# EAGLE design networking-node (EAGLE 7.6.0)
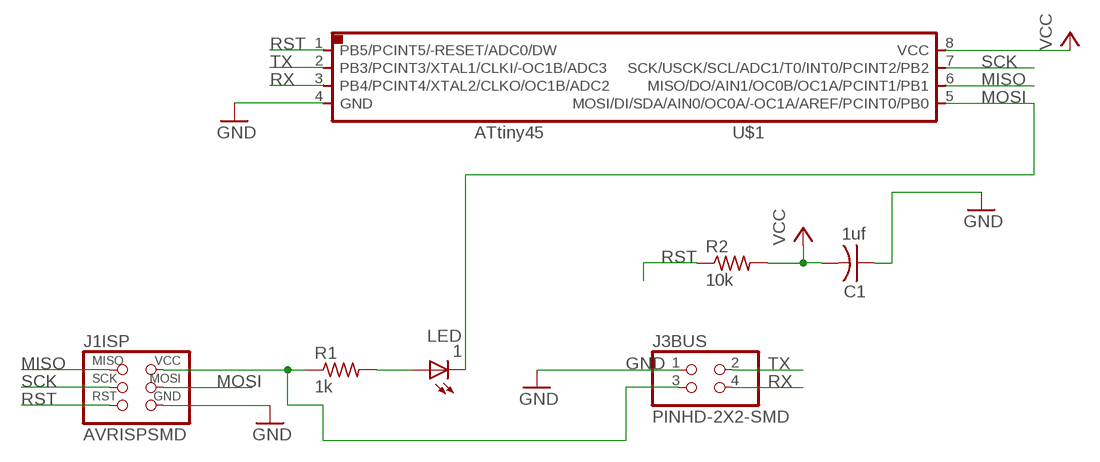
[diagram p0: schematic, sheet 1]

## Parts
1  LED  [LED1206]
C1  1uf  CAP-US1206FAB  [C1206FAB]
J1ISP  AVRISPSMD  [2X03SMD]
J3BUS  PINHD-2X2-SMD  [2X02SMD]
R1  1k  RES-US1206  [R1206]
R2  10k  RES-US1206  [R1206]
U$1  ATTINY45SI  [SOIC8]

## Nets
GND: C1.1 J1ISP.6(GND) J3BUS.1 U$1.4(GND)
MISO: J1ISP.1(MISO) U$1.6(MISO/DO/AIN1/OC0B/OC1A/PCINT1/PB1)
MOSI: 1.2(C) J1ISP.4(MOSI) U$1.5(MOSI/DI/SDA/AIN0/OC0A/-OC1A/AREF/PCINT0/PB0)
N$2: J1ISP.2(VCC) J3BUS.3
N$15: 1.1(A) R1.2
RST: J1ISP.5(RST) R2.1 U$1.1(PB5/PCINT5/-RESET/ADC0/DW)
RX: J3BUS.4 U$1.3(PB4/PCINT4/XTAL2/CLKO/OC1B/ADC2)
SCK: J1ISP.3(SCK) U$1.7(SCK/USCK/SCL/ADC1/T0/INT0/PCINT2/PB2)
TX: J3BUS.2 U$1.2(PB3/PCINT3/XTAL1/CLKI/-OC1B/ADC3)
VCC: C1.2 R2.2 U$1.8(VCC)
Unconnected: R1.1

## Library data of the parts
1 = fab:LED: LED
C1 = fab:CAP-US
J1ISP = fab:AVRISP
J3BUS = fab:PINHD-2X2-SMD
R1 R2 = fab:RES-US: Resistor (US Symbol) Variants with postfix FAB are widened to allow the routing of internal traces
U$1 = fab:ATTINY45

## Board
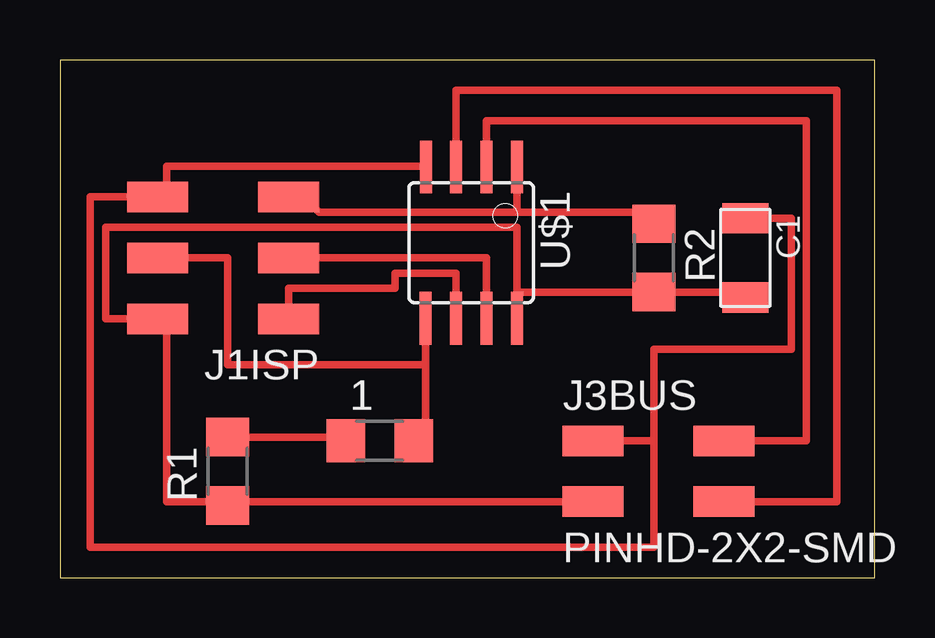
[diagram p1: board, top side]

Size 33.96 x 21.58 mm. Coordinates in mm from the lower left corner, seen from the top.
Outline: 0,0 33.96,0 33.96,21.58 0,21.58 0,0
Copper layers (1*16): Top 0.035mm / dielectric 1.5mm / Bottom 0.035mm
Design rules "default": minimum track width 10mil, minimum drill 24mil, track to track 8mil, track to pad 8mil, pad to pad 8mil, via to via 8mil, smd to smd 8mil, copper to edge 40mil, drill to drill 8mil, minimum pad ring 10mil, minimum via ring 8mil, stop-mask expansion 4mil, vias tented up to drill 0mil, thermal gap 10mil

### Footprints (pad centres in the part's own frame; a part is rotated, then mirrored left to right if it is on the bottom)
LED1206 = smd 1.6 x 1.803: 1 -1.422,0; 2 1.422,0
C1206FAB = smd 1.27 x 1.905: 1 -1.651,0; 2 1.651,0
2X03SMD = smd 2.54 x 1.27: 1 -2.54,2.54; 2 2.92,2.54; 3 -2.54,0; 4 2.92,0; 5 -2.54,-2.54; 6 2.92,-2.54
2X02SMD = smd 2.54 x 1.27: 1 -2.54,1.27; 2 2.92,1.27; 3 -2.54,-1.27; 4 2.92,-1.27
R1206 = smd 1.6 x 1.803: 1 -1.422,0; 2 1.422,0
SOIC8 = smd 0.5 x 2.2: 1 -1.905,-3.154; 2 -0.645,-3.154; 3 0.625,-3.154; 4 1.895,-3.154; 5 1.905,3.154; 6 0.635,3.154; 7 -0.635,3.154; 8 -1.905,3.154

### Placement (x,y rotation side)
1  13.34,5.71 0 top
C1  28.57,13.33 270 top
J1ISP  6.99,13.33 180 top
J3BUS  24.77,4.45 0 top
R1  6.99,4.45 90 top
R2  24.77,13.33 270 top
U$1  17.14,13.97 180 top

### Tracks (layer width: path | path; a pad name or v marks a point on that pad's centre or on a via)
GND
  Top 0.305: U$1.4 15.25,17.15 4.44,17.15 4.44,15.88 J1ISP.6 1.27,15.88 1.27,1.27 24.77,1.27 24.77,5.71 | C1.1 30.48,14.99 30.48,9.53 24.77,9.53 24.77,6.35 24.77,5.71 | J3BUS.1 24.77,5.71
MISO
  Top 0.305: J1ISP.1 9.53,12.06 13.97,12.06 13.97,12.7 16.51,12.7 U$1.6
MOSI
  Top 0.305: J1ISP.4 6.99,13.33 6.99,8.89 15.24,8.89 | 15.24,8.89 15.24,5.71 1.2 | 15.24,8.89 U$1.5
N$2
  Top 0.305: J1ISP.2 4.44,10.79 4.44,3.17 J3BUS.3
N$15
  Top 0.305: R1.2 11.91,5.87 1.1
RST
  Top 0.305: J1ISP.5 10.16,15.88 10.79,15.24 19.05,15.24 | U$1.1 19.05,15.24 | 19.05,15.24 24.77,15.24 R2.1
RX
  Top 0.305: U$1.3 16.51,17.12 16.51,20.32 32.38,20.32 32.38,3.17 J3BUS.4
SCK
  Top 0.305: J1ISP.3 17.78,13.33 U$1.7
TX
  Top 0.305: U$1.2 17.78,17.12 17.78,19.05 31.12,19.05 31.12,5.71 J3BUS.2
VCC
  Top 0.305: U$1.8 19.05,11.91 | 4.44,10.79 1.91,10.79 1.91,14.61 19.05,14.61 19.05,12.06 19.05,11.91 | C1.2 28.57,11.91 R2.2 19.05,11.91